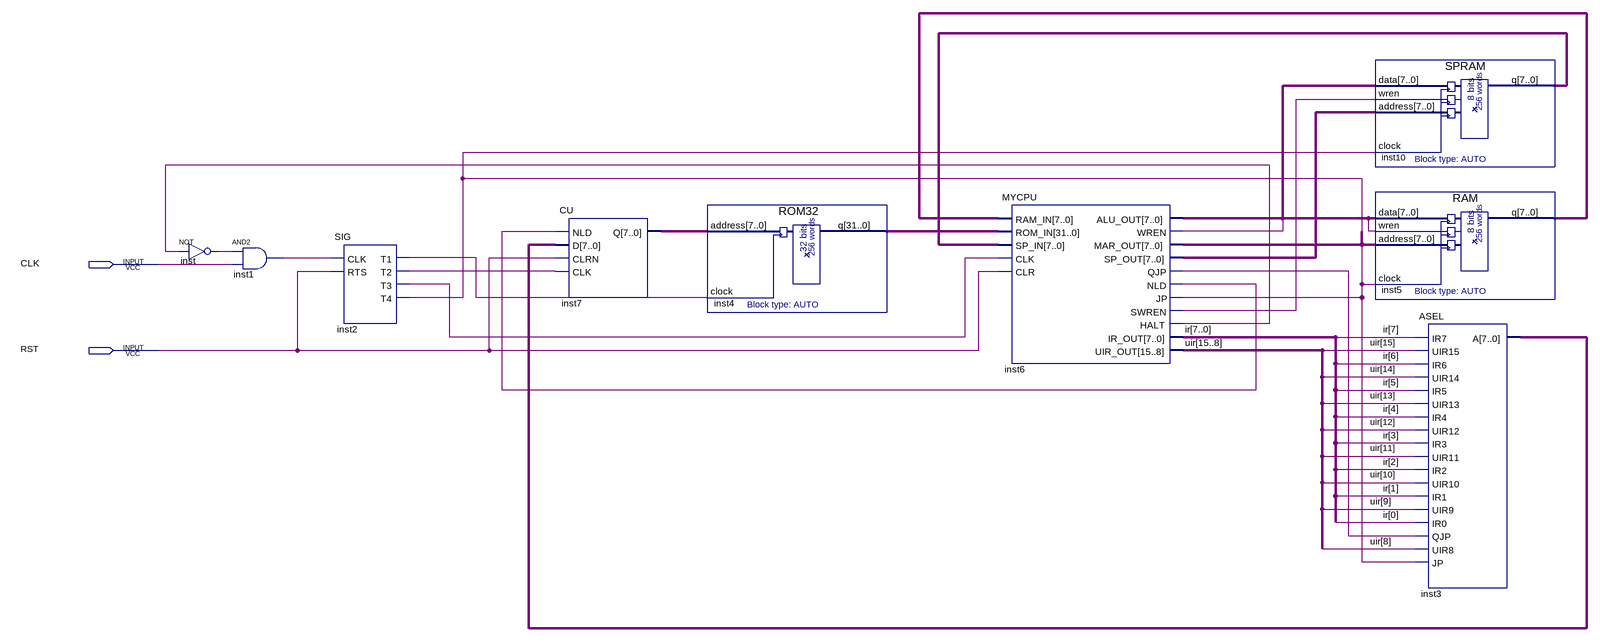
[diagram p0: schematic sheet]
// Quartus schematic test3.bdf as structural Verilog: 9 symbols, 2 pins
module test3 (
  input  CLK,
  input  RST
);

  wire inst1_out, inst2_t1, inst2_t2, inst2_t3, inst2_t4, inst6_halt, inst6_jp, inst6_nld, inst6_qjp,
       inst6_swren, inst6_wren, inst_out, undriven;
  wire [7:0] inst3_a, inst5_q, inst6_alu_out, inst6_mar_out, inst6_sp_out, inst7_q, inst10_q, ir;
  wire [15:8] uir;
  wire [31:0] inst4_q;

  not inst (inst_out, inst6_halt);
  and inst1 (inst1_out, inst_out, CLK);
  SIG inst2 (.CLK(inst1_out), .RTS(RST), .T1(inst2_t1), .T2(inst2_t2), .T3(inst2_t3), .T4(inst2_t4));
  CU inst7 (.NLD(inst6_nld), .D(inst3_a), .CLRN(RST), .CLK(inst2_t2), .Q(inst7_q));
  ROM32 inst4 (.address(inst7_q), .clock(inst2_t1), .q(inst4_q));
  MYCPU inst6 (
    .RAM_IN(inst5_q), .ROM_IN(inst4_q), .SP_IN(inst10_q), .CLK(inst2_t3), .CLR(RST), .ALU_OUT(inst6_alu_out),
    .WREN(inst6_wren), .MAR_OUT(inst6_mar_out), .SP_OUT(inst6_sp_out), .QJP(inst6_qjp), .NLD(inst6_nld),
    .JP(inst6_jp), .SWREN(inst6_swren), .HALT(inst6_halt), .IR_OUT(ir), .UIR_OUT(uir));
  SPRAM inst10 (.data(inst6_alu_out), .wren(inst6_swren), .address(inst6_sp_out), .clock(inst2_t4), .q(inst10_q));
  RAM inst5 (.data(inst6_alu_out), .wren(undriven), .address(inst6_mar_out), .clock(inst6_jp), .q(inst5_q));
  ASEL inst3 (
    .IR7(ir[7]), .UIR15(uir[15]), .IR6(ir[6]), .UIR14(uir[14]), .IR5(ir[5]), .UIR13(uir[13]), .IR4(ir[4]),
    .UIR12(uir[12]), .IR3(ir[3]), .UIR11(uir[11]), .IR2(ir[2]), .UIR10(uir[10]), .IR1(ir[1]), .UIR9(uir[9]),
    .IR0(ir[0]), .QJP(inst6_qjp), .UIR8(uir[8]), .JP(inst6_jp), .A(inst3_a));
endmodule
